# EAGLE schematic HG0B1CEU (EAGLE 9.6.1)

## Sheet 1 of 2
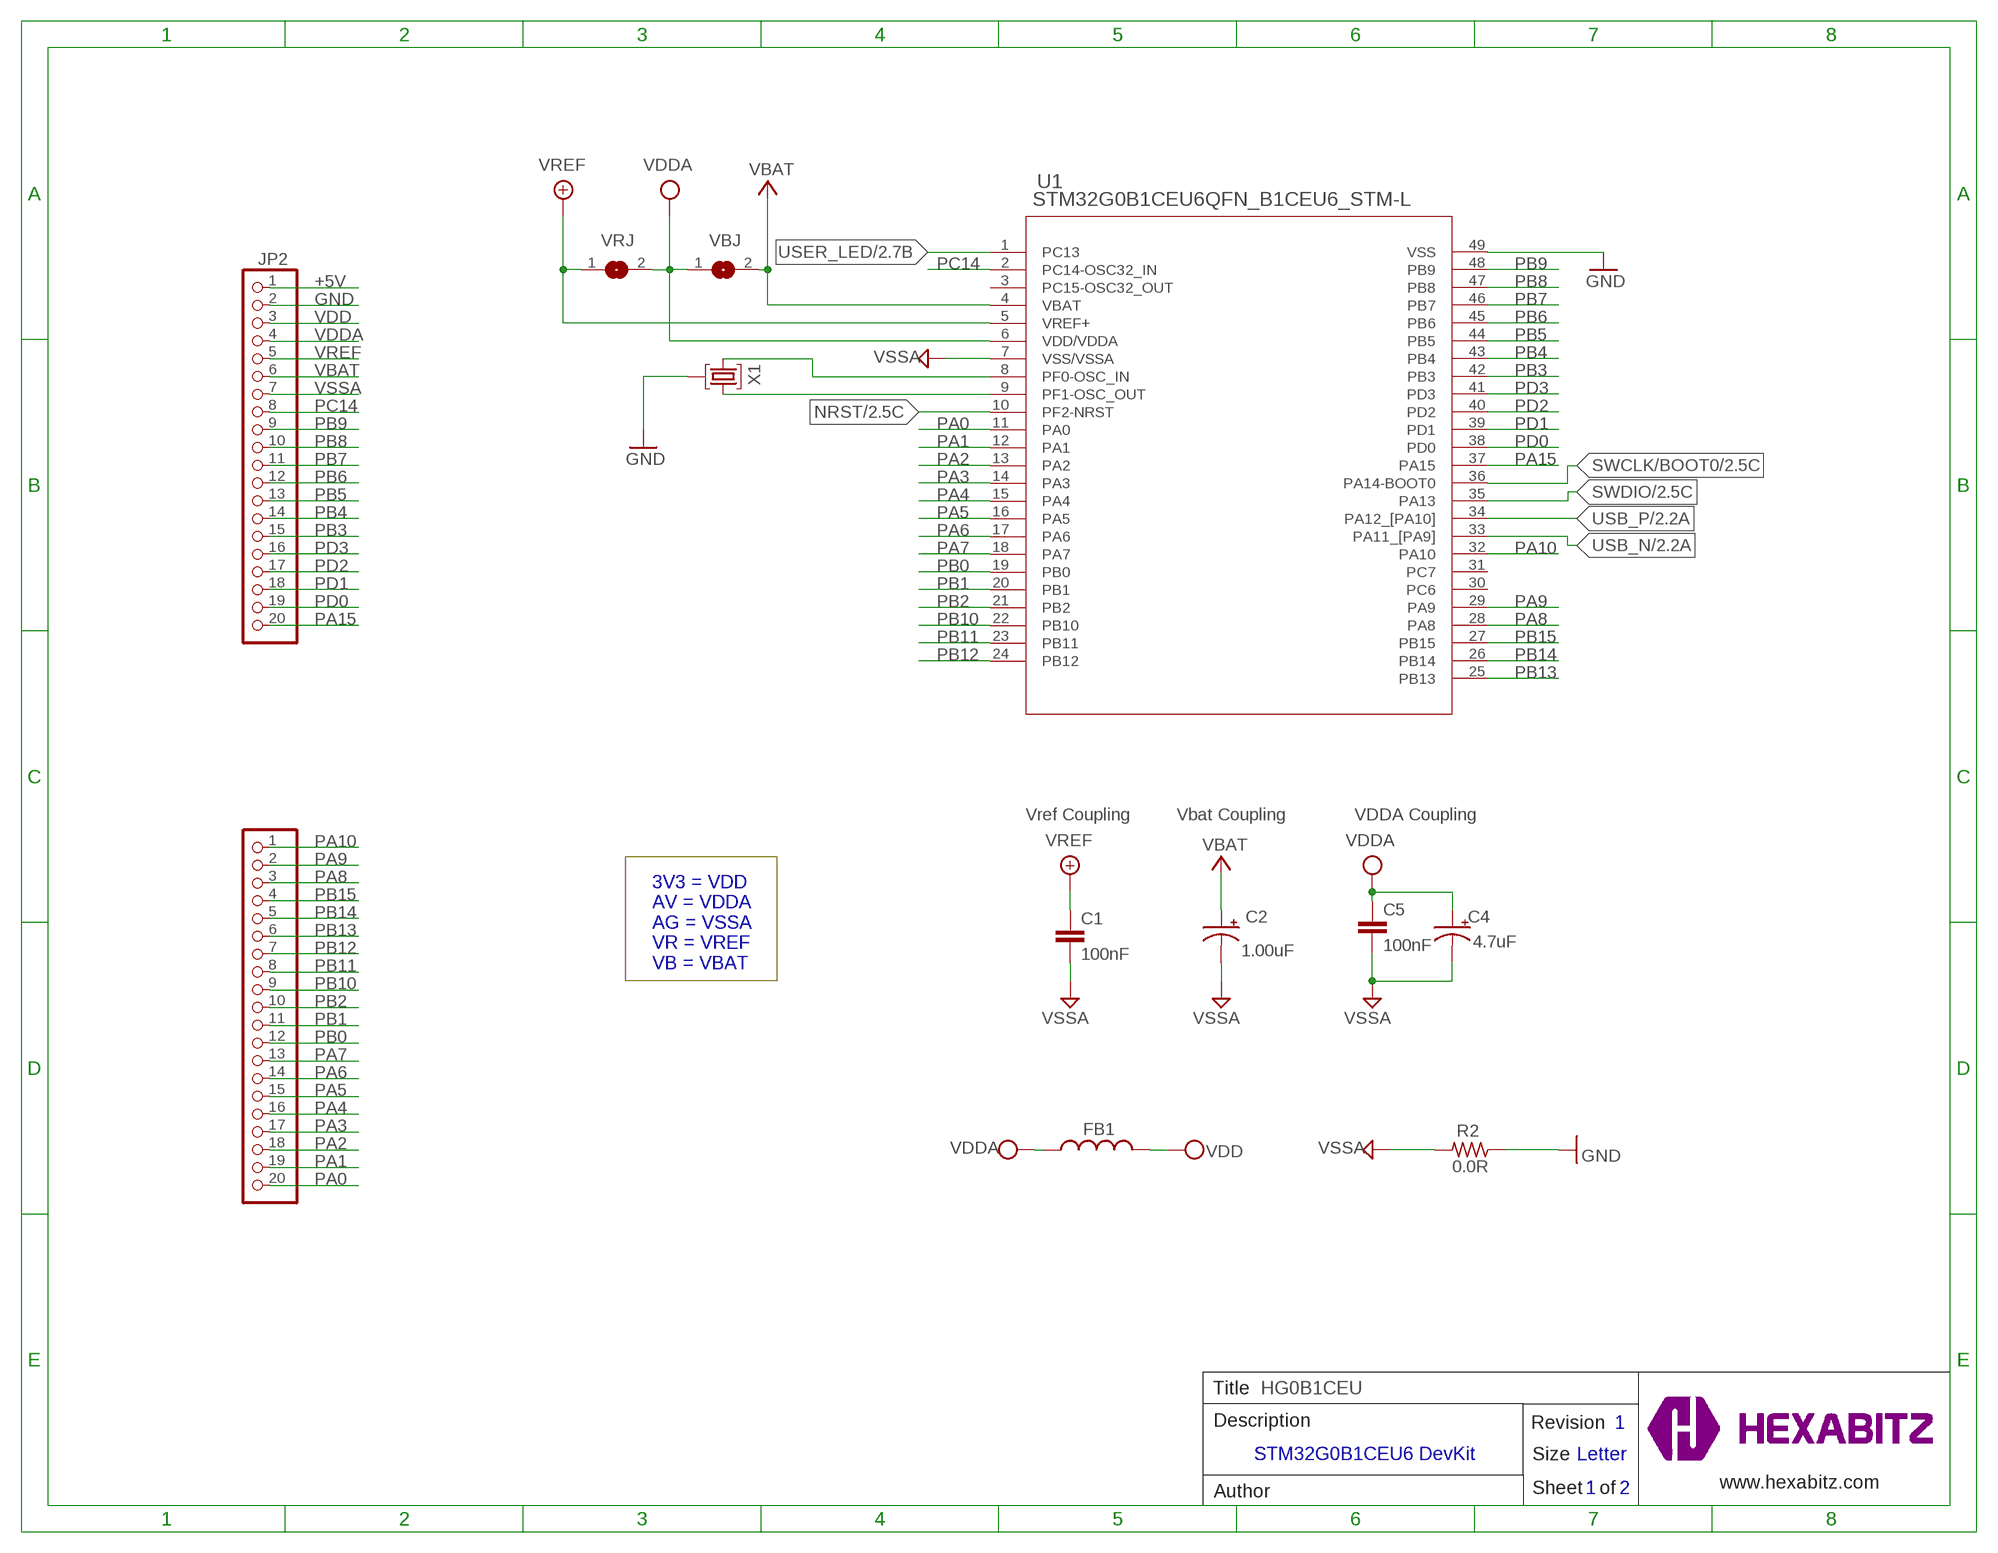
[diagram p0: schematic, sheet 1]

### Parts
C1  100nF  C-0603  [C-0603]
C2  1.00uF  C-0805-POL  [C-0805-POL]
C4  4.7uF  C-0805-POL  [C-0805-POL]
C5  100nF  C-0603  [C-0603]
FB1  FB-TDK_MMZ1608Y300B  [FB-TDK_MMZ1608Y300B]
JP1  PINHD-1X20  [1X20]
JP2  PINHD-1X20  [1X20]
R2  0.0R  R-0603  [R-0603]
U1  STM32G0B1CEU6QFN_B1CEU6_STM-L  [QFN_B1CEU6_STM-L]
VBJ  SJ  [SJ]
VRJ  SJ  [SJ]
X1  XTALL_CSTCE8M00G52  [XTALL_CSTCE8M00G52]

### Nets
+5V: JP2.1 ; also sheet 2
CRYSTAL_N: U1.8(PF0-OSC_IN) X1.P$1
CRYSTAL_P: U1.9(PF1-OSC_OUT) X1.P$3
GND: JP2.2 R2.1 U1.49(VSS) X1.P$2 ; also sheet 2
NRST: U1.10(PF2-NRST) ; also sheet 2
PA0: JP1.20 U1.11(PA0)
PA1: JP1.19 U1.12(PA1)
PA2: JP1.18 U1.13(PA2)
PA3: JP1.17 U1.14(PA3)
PA4: JP1.16 U1.15(PA4)
PA5: JP1.15 U1.16(PA5)
PA6: JP1.14 U1.17(PA6)
PA7: JP1.13 U1.18(PA7)
PA8: JP1.3 U1.28(PA8)
PA9: JP1.2 U1.29(PA9)
PA10: JP1.1 U1.32(PA10)
PA15: JP2.20 U1.37(PA15)
PB0: JP1.12 U1.19(PB0)
PB1: JP1.11 U1.20(PB1)
PB2: JP1.10 U1.21(PB2)
PB3: JP2.15 U1.42(PB3)
PB4: JP2.14 U1.43(PB4)
PB5: JP2.13 U1.44(PB5)
PB6: JP2.12 U1.45(PB6)
PB7: JP2.11 U1.46(PB7)
PB8: JP2.10 U1.47(PB8)
PB9: JP2.9 U1.48(PB9)
PB10: JP1.9 U1.22(PB10)
PB11: JP1.8 U1.23(PB11)
PB12: JP1.7 U1.24(PB12)
PB13: JP1.6 U1.25(PB13)
PB14: JP1.5 U1.26(PB14)
PB15: JP1.4 U1.27(PB15)
PC14: JP2.8 U1.2(PC14-OSC32_IN)
PD0: JP2.19 U1.38(PD0)
PD1: JP2.18 U1.39(PD1)
PD2: JP2.17 U1.40(PD2)
PD3: JP2.16 U1.41(PD3)
SWCLK/BOOT0: U1.36(PA14-BOOT0) ; also sheet 2
SWDIO: U1.35(PA13) ; also sheet 2
USB_N [diff pairs]: U1.33(PA11_[PA9]) ; also sheet 2
USB_P [diff pairs]: U1.34(PA12_[PA10]) ; also sheet 2
USER_LED: U1.1(PC13) ; also sheet 2
VBAT: C2.1(+) JP2.6 U1.4(VBAT) VBJ.2
VDD: FB1.2 JP2.3 ; also sheet 2
VDDA: C4.1(+) C5.1 FB1.1 JP2.4 U1.6(VDD/VDDA) VBJ.1 VRJ.2
VREF: C1.1 JP2.5 U1.5(VREF+) VRJ.1
VSSA: C1.2 C2.2(-) C4.2(-) C5.2 JP2.7 R2.2 U1.7(VSS/VSSA)
Unconnected: U1.3(PC15-OSC32_OUT) U1.30(PC6) U1.31(PC7)

### Notes on the sheet
- C:/Users/Admin/Desktop/logodraft.bmp
- Vref Coupling | Vbat Coupling | VDDA Coupling
- 3V3 = VDD
  AV = VDDA
  AG = VSSA
  VR = VREF
  VB = VBAT
- Title | HG0B1CEU
- Description | Revision | 1
- STM32G0B1CEU6 DevKit
- Size | Letter
- www.hexabitz.com
- Author | Sheet   of | 1 | 2

## Sheet 2 of 2
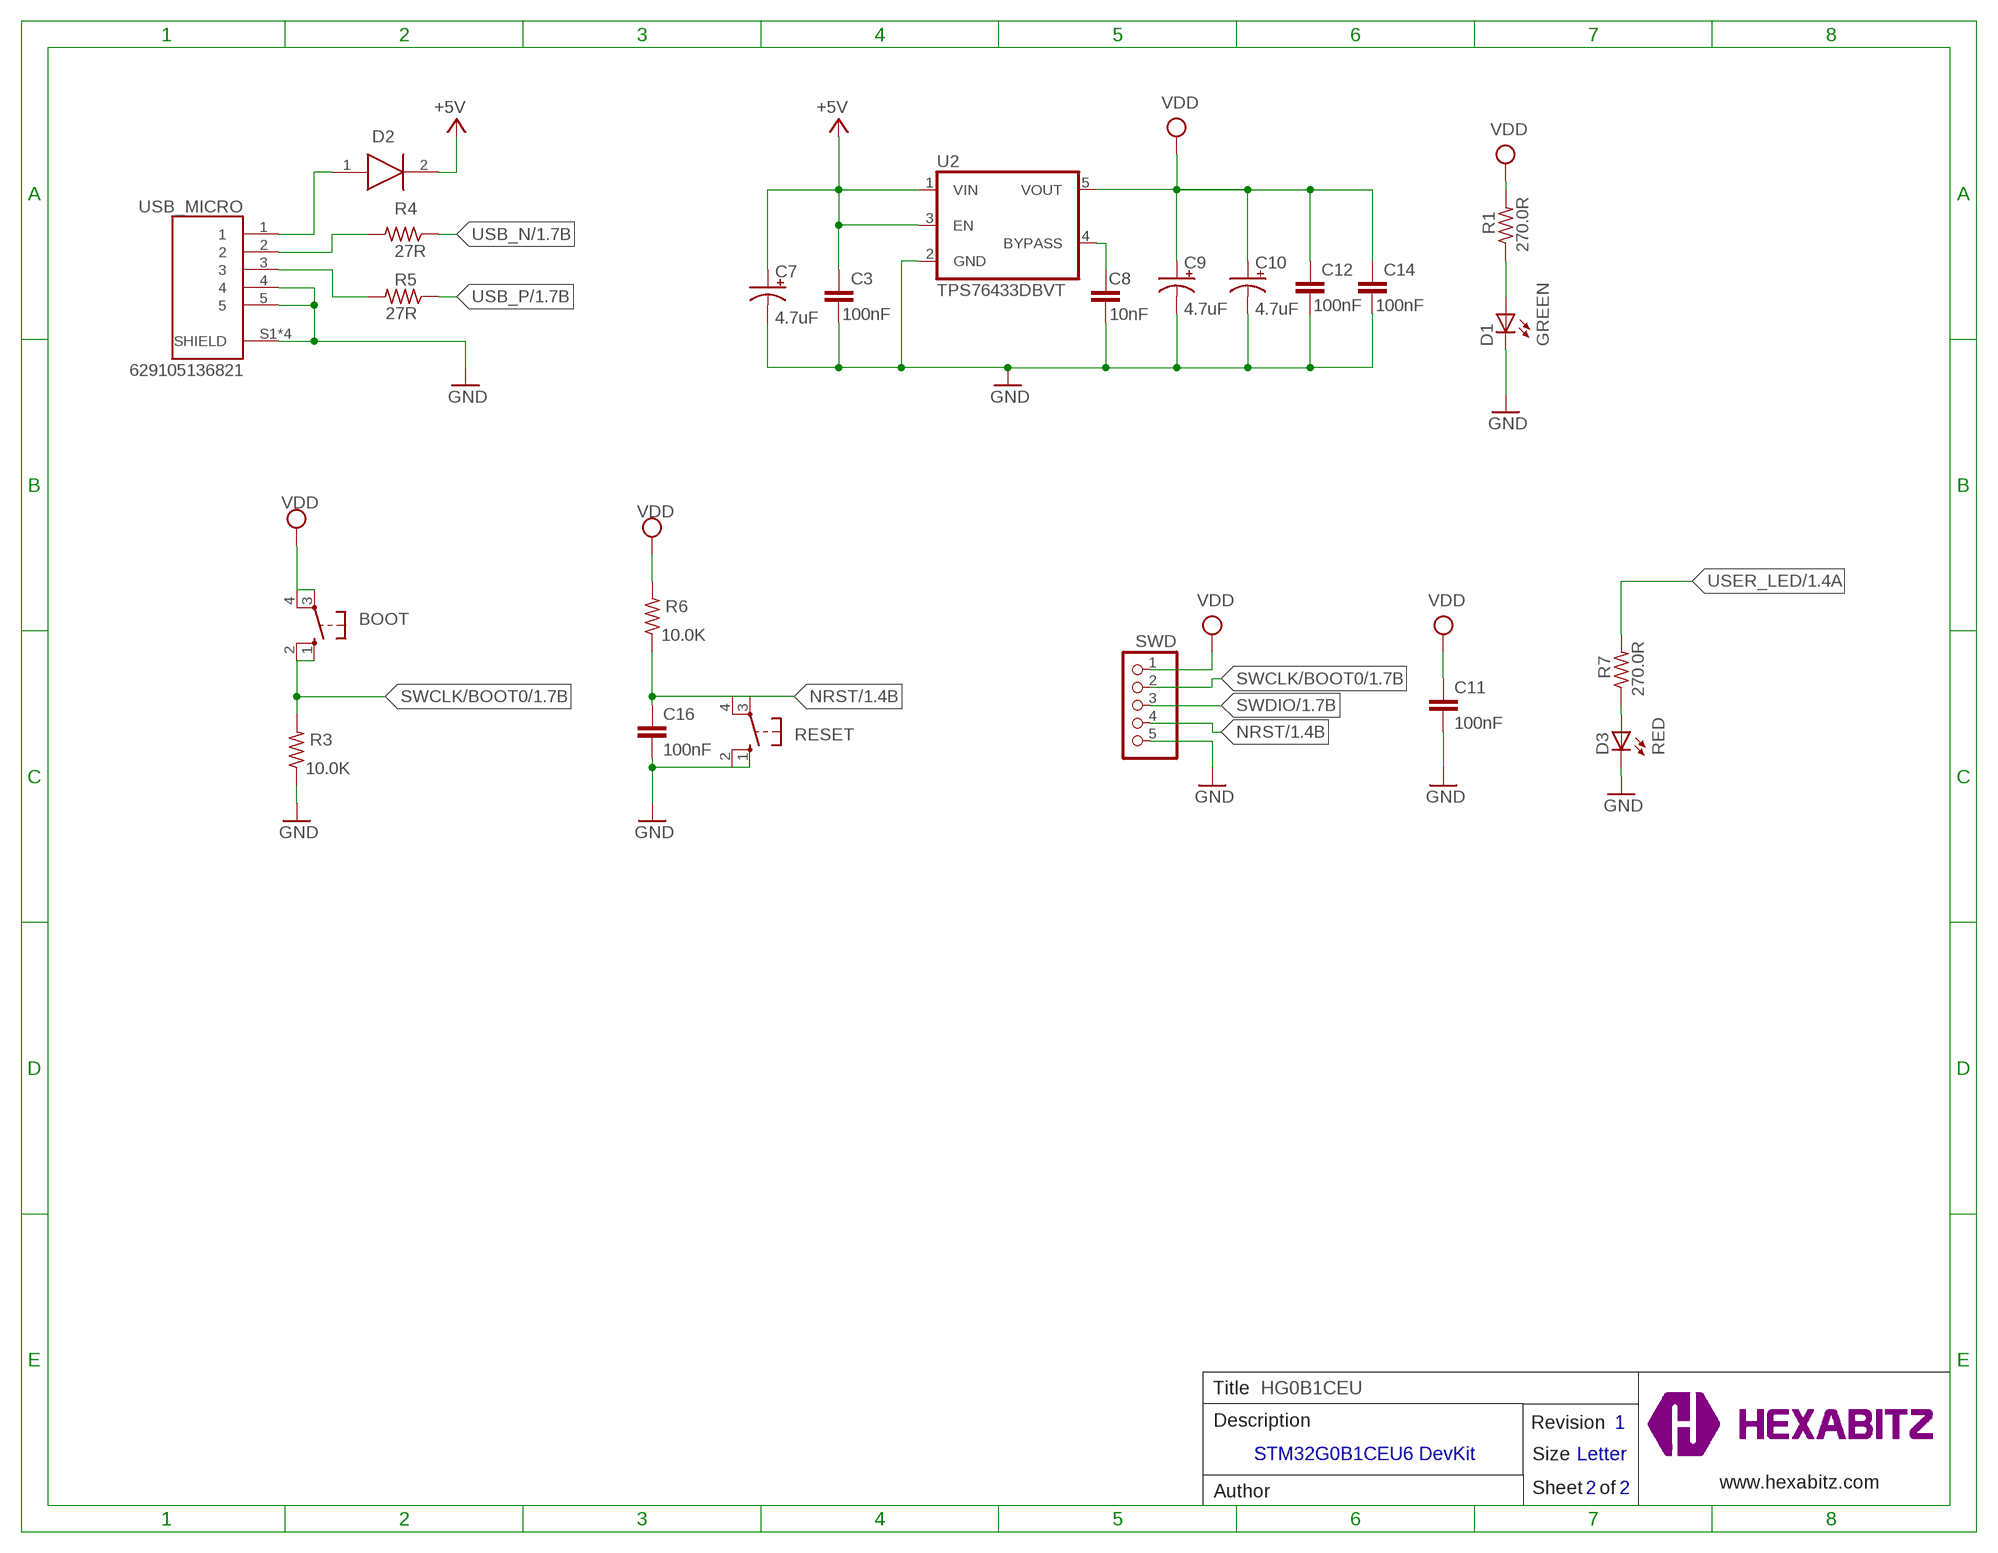
[diagram p1: schematic, sheet 2]

### Parts
BOOT  10-XX  [B3F-10XX]
C3  100nF  C-0603  [C-0603]
C7  4.7uF  C-0805-POL  [C-0805-POL]
C8  10nF  C-0603  [C-0603]
C9  4.7uF  C-0805-POL  [C-0805-POL]
C10  4.7uF  C-0805-POL  [C-0805-POL]
C11  100nF  C-0603  [C-0603]
C12  100nF  C-0603  [C-0603]
C14  100nF  C-0603  [C-0603]
C16  100nF  C-0603  [C-0603]
D1  GREEN  VLMS1300-GS08  [VLMS1300-GS08]
D2  FSM17PL-TP  [FSM17PL-TP]
D3  RED  VLMS1300-GS08  [VLMS1300-GS08]
R1  270.0R  R-0603  [R-0603]
R3  10.0K  R-0603  [R-0603]
R4  27R  R-0603  [R-0603]
R5  27R  R-0603  [R-0603]
R6  10.0K  R-0603  [R-0603]
R7  270.0R  R-0603  [R-0603]
RESET  10-XX  [B3F-10XX]
SWD  PINHD-1X5/90  [1X05/90]
U2  TPS76433DBVT  [SOT25]
USB_MICRO  629105136821  [WE_629105136821]

### Nets
+5V: C3.1 C7.1(+) D2.2(K) U2.1(VIN) U2.3(EN) ; also sheet 1
D_N [diff pairs]: R4.2 USB_MICRO.2
D_P [diff pairs]: R5.2 USB_MICRO.3
GND: C3.2 C7.2(-) C8.2 C9.2(-) C10.2(-) C11.2 C12.2 C14.2 C16.2 D1.C D3.C R3.1 RESET.1(S) RESET.2(S1) SWD.5 U2.2(GND) USB_MICRO.4 USB_MICRO.5 USB_MICRO.S1(SHIELD) USB_MICRO.S2(SHIELD) USB_MICRO.S3(SHIELD) USB_MICRO.S4(SHIELD) ; also sheet 1
N$1: D2.1(A) USB_MICRO.1
N$2: D3.A R7.1
N$4: D1.A R1.1
N$9: C8.1 U2.4(BYPASS)
NRST: C16.1 R6.1 RESET.3(P) RESET.4(P1) SWD.4 ; also sheet 1
SWCLK/BOOT0: BOOT.1(S) BOOT.2(S1) R3.2 SWD.2 ; also sheet 1
SWDIO: SWD.3 ; also sheet 1
USB_N [diff pairs]: R4.1 ; also sheet 1
USB_P [diff pairs]: R5.1 ; also sheet 1
USER_LED: R7.2 ; also sheet 1
VDD: BOOT.3(P) BOOT.4(P1) C9.1(+) C10.1(+) C11.1 C12.1 C14.1 R1.2 R6.2 SWD.1 U2.5(VOUT) ; also sheet 1

### Notes on the sheet
- Title | HG0B1CEU
- Description | Revision | 1
- STM32G0B1CEU6 DevKit
- Size | Letter
- www.hexabitz.com
- Author | Sheet   of | 2 | 2

## Library data of the parts
BOOT RESET = switch-omron:10-XX: OMRON SWITCH; MPN: B3F-1000; OC_FARNELL: 176432; OC_NEWARK: 36M3542
C1 C11 C16 = HEXABITZ_RCLS:C-0603: CAP CER 10% X7R 0603; CAPACITANCE: 100nF; MFN: KEMET; MPN: C0603C104K8RACTU; OCTOPART_URL: https://octopart.com/c0603c104k8ractu-kemet-145075?r=sp&s=9bS9ASSwSEqMCE9KBEQZ0g; TOLERANCE: 10%; VOLTAGE_RATING: 10V
C2 = HEXABITZ_RCLS:C-0805-POL: Cap Tant Solid SMD 2012; CAPACITANCE: 1.00uF; MFN: Yageo; MPN: CC0805KKX7R7BB105; OCTOPART_URL: https://octopart.com/cc0805kkx7r7bb105-yageo-8376555?r=sp&s=YKl1wwtkROau_X5nniH2ig; TOLERANCE: 10%; VOLTAGE_RATING: 16V
C3 C5 C8 C12 C14 = HEXABITZ_RCLS:C-0603: CAP CER 10% X7R 0603; CAPACITANCE: 100nF; MFN: KEMET; MPN: C0603C104K8RACTU; OCTOPART_URL: https://octopart.com/c0603c104k8ractu-kemet-145075?r=sp&s=9bS9ASSwSEqMCE9KBEQZ0g; TOLERANCE: 10%; VOLTAGE_RATING: 10
C4 C7 C9 C10 = HEXABITZ_RCLS:C-0805-POL: Cap Tant Solid SMD 2012; CAPACITANCE: 4.7uF; MFN: Murata; MPN: GRM21BC81E475KA12L; OCTOPART_URL: https://octopart.com/grm21bc81e475ka12l-murata-10331911?r=sp&s=RY3qZSD8T6mG6TC9CHI5qQ; TOLERANCE: 10%; VOLTAGE_RATING: 25V
D1 = HEXABITZ_USER_INTERFACE_PARTS:VLMS1300-GS08: Red 0603 130° Clear 54 mcd 2 V Surface Mount ChipLED ; Octopart Url : http://octopart.com/vlms1300-gs08-vishay-21709201; MFN: Vishay; MPN: VLMS1300-GS08; OCTOPART_URL: https://octopart.com/vlms1300-gs08-vishay-21709201?r=sp&s=_gcP4_q8T1SC6PJQPTQ9yA; VALUE: RED
D2 = HEXABITZ_RCLS:FSM17PL-TP: 1.0 A Surface Mount Schottky Barrier Rectifier, 40 V, -65 to 125 degC, 2-Pin SOD-123 Package, RoHS, Tape and Reel
D3 = HEXABITZ_USER_INTERFACE_PARTS:VLMS1300-GS08: Red 0603 130° Clear 54 mcd 2 V Surface Mount ChipLED ; Octopart Url : http://octopart.com/vlms1300-gs08-vishay-21709201; MFN: Vishay; MPN: VLMS1300-GS08; OCTOPART_URL: https://octopart.com/vlms1300-gs08-vishay-21709201?r=sp&s=_gcP4_q8T1SC6PJQPTQ9yA
FB1 = HEXABITZ_RCLS:FB-TDK_MMZ1608Y300B: Ferrite Beads Multi-Layer 30Ohm 25% 100MHz 1.5A 50mOhm DCR 0603; MFN: TDK; MPN: MMZ1608Y300B; OCTOPART_URL: https://octopart.com/mmz1608y300b-tdk-368280?r=sp&s=cd9_2ZEqQ9q9UNBuQgHAiA
JP1 JP2 = pinhead:PINHD-1X20: PIN HEADER
R1 R7 = HEXABITZ_RCLS:R-0603: Thick Film Resistors - SMD 0603; MFN: Yageo; MPN: RC0603FR-07270RL; OCTOPART_URL: https://octopart.com/search?q=RC0603FR-07270RL&start=0; RESISTANCE: 270.0 Ohm; TOLERANCE: 1%
R2 = HEXABITZ_RCLS:R-0603: Thick Film Resistors - SMD 0603; MFN: Yageo; MPN: RC0603JR-070RL; OCTOPART_URL: https://octopart.com/rc0603jr-070rl-yageo-1241539?r=sp&s=X2NteqRjRNWrnx42Y0aliA; RESISTANCE: 0.0 Ohm
R3-R6 = HEXABITZ_RCLS:R-0603: Thick Film Resistors - SMD 0603; MFN: Yageo; MPN: RC0603JR-0710KL; OCTOPART_URL: https://octopart.com/search?q=RC0603JR-0710KL&start=0; RESISTANCE: 10.0K Ohm; TOLERANCE: 5%
SWD = pinhead:PINHD-1X5: PIN HEADER
U1 = HEXABITZ_ICs:STM32G0B1CEU6; COPYRIGHT: Copyright (C) 2021 Ultra Librarian. All rights reserved.; MANUFACTURER_PART_NUMBER: STM32G0B1CEU6; MFR_NAME: STMicroelectronics
U2 = HEXABITZ_ICs:TPS764: 150mA Low Noise LDO Voltage Regulator with Enable; MFN: Texas Instruments; MPN: TPS76433DBVT; OCTOPART_URL: https://octopart.com/tps76433dbvt-texas+instruments-69873?r=sp&s=0aHKKhMLSUCTmmqJkhwwIQ
USB_MICRO = 629105136821:629105136821: WR-COM SMT Horizontal 5 Contacts Micro USB Type B,5 pins Check availability <https://pricing.snapeda.com/parts/629105136821/W%C3%BCrth%20Elektronik/view-part?ref=eda>; AVAILABILITY: In Stock; DESCRIPTION: USB - micro B USB 2.0 Receptacle Connector 5 Position Surface Mount, Right Angle; MF: Würth Elektronik; MP: 629105136821; PACKAGE: None; PRICE: None; PURCHASE-URL: https://pricing.snapeda.com/search/part/629105136821/?ref=eda
VBJ VRJ = jumper:SJ: SMD solder JUMPER
X1 = HEXABITZ_OTHER_PARTS:XTALL_CSTCE8M00G52: MURATA CSTCE8M00G52-R0 RESONATOR, SMD, 8MHZ ; Octopart Url : https://octopart.com/cstce8m00g52-r0-murata-7145559; MFN: Murata; MPN: CSTCE8M00G52Z-R0; OCTOPART_URL: https://octopart.com/cstce8m00g52z-r0-murata-17755941?r=sp&s=JDnNJnrHQhyS8Zk4ofFWXw

## Net classes
1 diff pairs: width 0.203 mm, clearance 0.178 mm